# EAGLE design light (EAGLE 7.5.0)
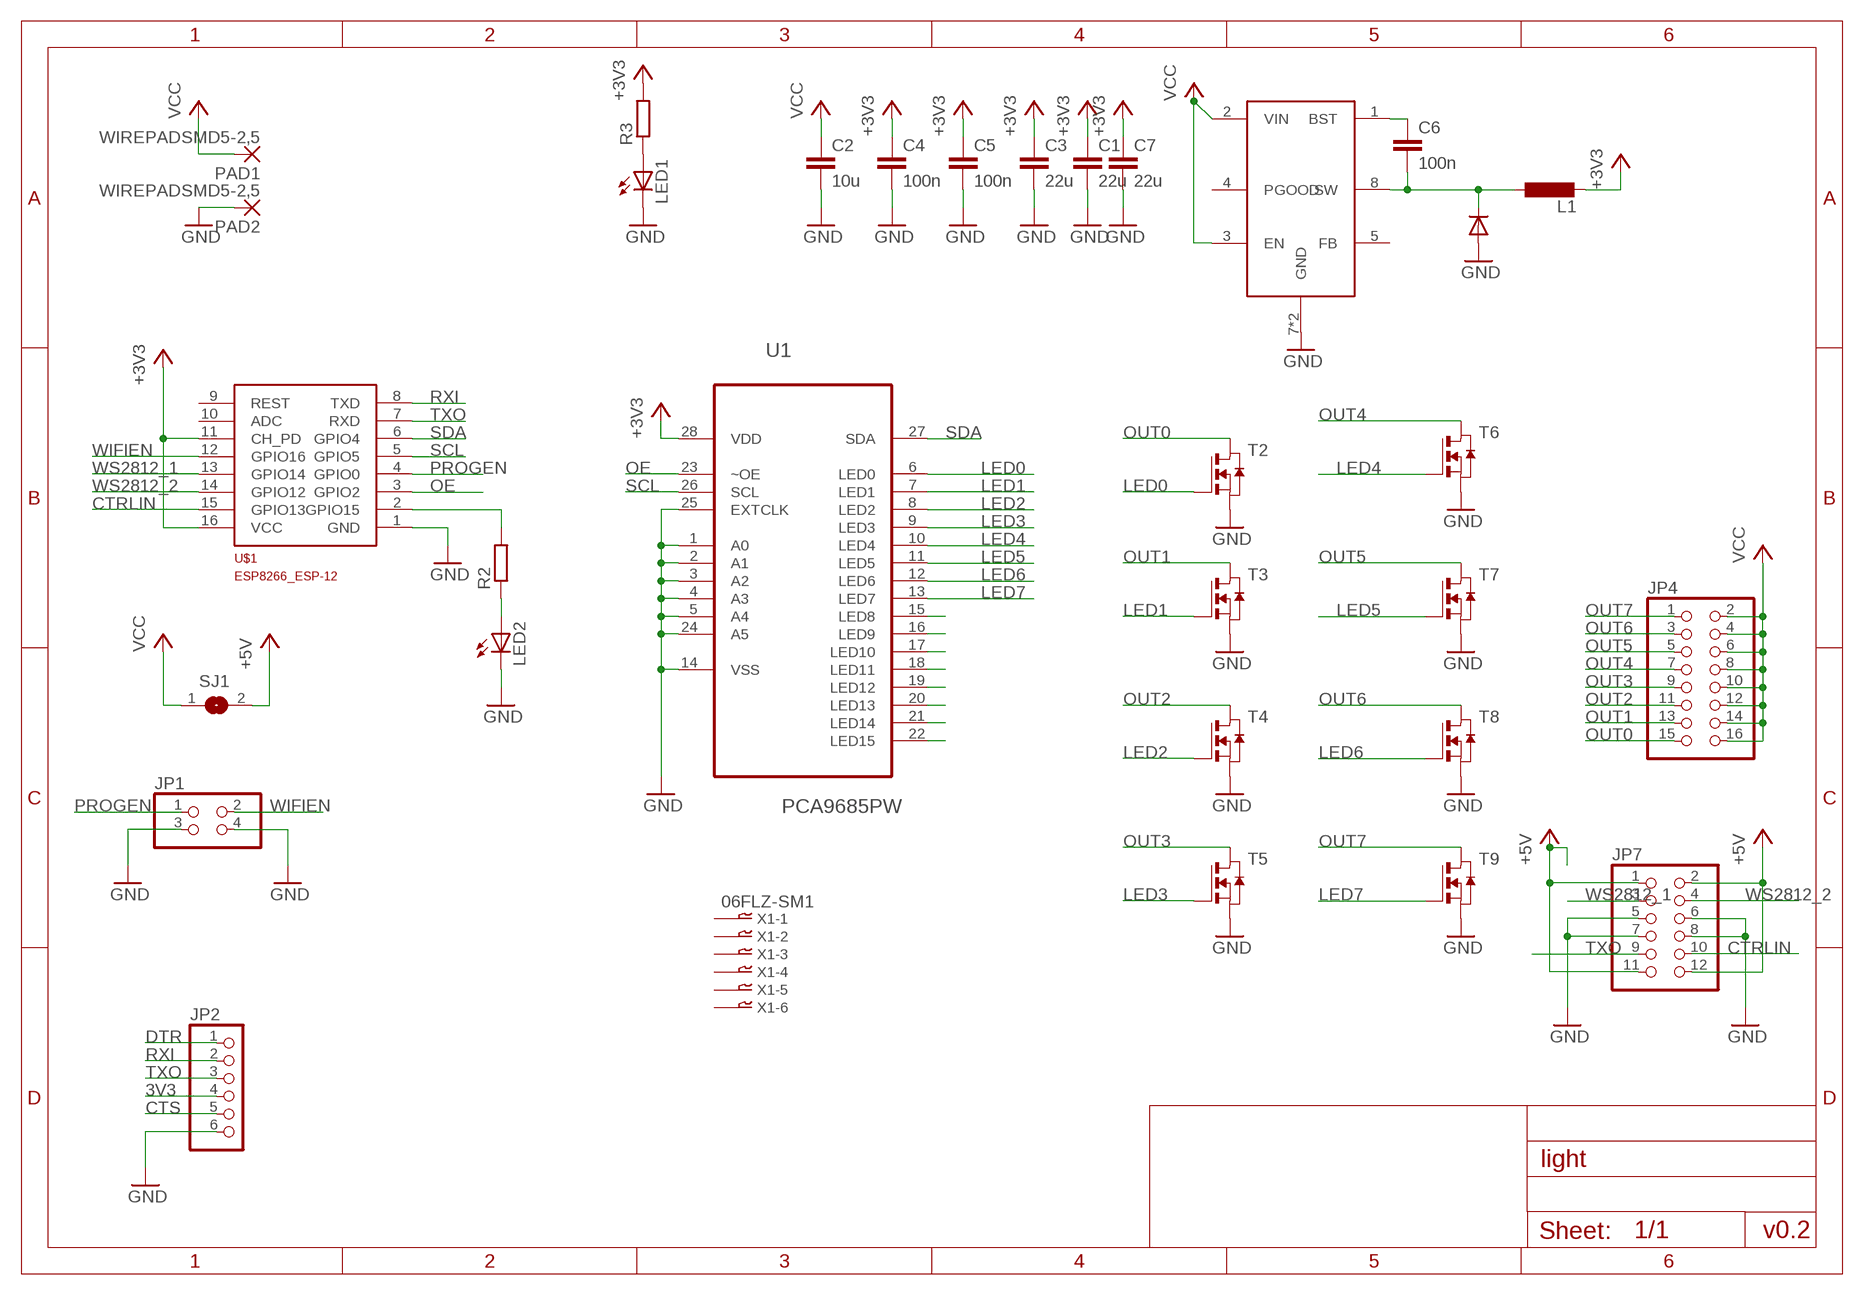
[diagram p0: schematic, sheet 1]

## Parts
C1  22u  C-EUC0805K  [C0805K]
C2  10u  C-EUC0805K  [C0805K]
C3  22u  C-EUC0805K  [C0805K]
C4  100n  C-EUC0603K  [C0603K]
C5  100n  C-EUC0603K  [C0603K]
C6  100n  C-EUC0603K  [C0603K]
C7  22u  C-EUC0805K  [C0805K]
JP1  PINHD-2X2  [2X02]
JP2  PINHD-1X6  [1X06]
JP4  PINHD-2X8  [2X08]
JP7  PINHD-2X6  [2X06]
L1  L-EUL5650M  [L5650M]
LED1  LEDSML0603  [SML0603]
LED2  LEDSML0603  [SML0603]
PAD1  WIREPADSMD5-2,5  [5-2,5]
PAD2  WIREPADSMD5-2,5  [5-2,5]
R2  R-EU_R0603  [R0603]
R3  R-EU_R0603  [R0603]
SJ1  SJ  [SJ]
T2  NMOSSOT23  [SOT-23]
T3  NMOSSOT23  [SOT-23]
T4  NMOSSOT23  [SOT-23]
T5  NMOSSOT23  [SOT-23]
T6  NMOSSOT23  [SOT-23]
T7  NMOSSOT23  [SOT-23]
T8  NMOSSOT23  [SOT-23]
T9  NMOSSOT23  [SOT-23]
U1  PCA9685PW  [SOP65P640X110-28N]
U$1  ESP8266_ESP-12  [ESP8266-ESP12]
U$2  ADP2302  [SOIC8G-1.27-5X4MM]
U$3  SSB43L  [DO-214AA]
X1  06FLZ-SM1  [6FLZ-SM]

## Nets
3V3: JP2.4
+3V3: C1.1 C3.1 C4.1 C5.1 C7.1 L1.2 R3.2 U1.28(VDD) U$1.11(CH_PD) U$1.16(VCC)
+5V: JP7.1 JP7.2 JP7.11 JP7.12 SJ1.2
CTRLIN: JP7.10 U$1.15(GPIO13)
CTS: JP2.5
DTR: JP2.1
GND: C1.2 C2.2 C3.2 C4.2 C5.2 C7.2 JP1.3 JP1.4 JP2.6 JP7.5 JP7.6 JP7.7 JP7.8 LED1.C LED2.C PAD2.1(P) T2.2(S) T3.2(S) T4.2(S) T5.2(S) T6.2(S) T7.2(S) T8.2(S) T9.2(S) U1.1(A0) U1.2(A1) U1.3(A2) U1.4(A3) U1.5(A4) U1.14(VSS) U1.24(A5) U1.25(EXTCLK) U$1.1(GND) U$2.7(GND) U$2.PAD(GND) U$3.+(A)
LED0: T2.3(G) U1.6(LED0)
LED1: T3.3(G) U1.7(LED1)
LED2: T4.3(G) U1.8(LED2)
LED3: T5.3(G) U1.9(LED3)
LED4: T6.3(G) U1.10(LED4)
LED5: T7.3(G) U1.11(LED5)
LED6: T8.3(G) U1.12(LED6)
LED7: T9.3(G) U1.13(LED7)
N$1: LED1.A R3.1
N$2: LED2.A R2.1
N$3: R2.2 U$1.2(GPIO15)
N$4: C6.1 U$2.1(BST)
N$5: U1.15(LED8)
N$6: U1.16(LED9)
N$7: U1.17(LED10)
N$8: U1.18(LED11)
N$9: U1.19(LED12)
N$10: U1.20(LED13)
N$11: U1.21(LED14)
N$12: U1.22(LED15)
N$13: C6.2 L1.1 U$2.8(SW) U$3.-(C)
OE: U1.23(~OE) U$1.3(GPIO2)
OUT0: JP4.15 T2.1(D)
OUT1: JP4.13 T3.1(D)
OUT2: JP4.11 T4.1(D)
OUT3: JP4.9 T5.1(D)
OUT4: JP4.7 T6.1(D)
OUT5: JP4.5 T7.1(D)
OUT6: JP4.3 T8.1(D)
OUT7: JP4.1 T9.1(D)
PROGEN: JP1.1 U$1.4(GPIO0)
RXI: JP2.2 U$1.8(TXD)
SCL: U1.26(SCL) U$1.5(GPIO5)
SDA: U1.27(SDA) U$1.6(GPIO4)
TXO: JP2.3 JP7.9 U$1.7(RXD)
VCC: C2.1 JP4.2 JP4.4 JP4.6 JP4.8 JP4.10 JP4.12 JP4.14 JP4.16 PAD1.1(P) SJ1.1 U$2.2(VIN) U$2.3(EN)
WIFIEN: JP1.2 U$1.12(GPIO16)
WS2812_1: JP7.3 U$1.13(GPIO14)
WS2812_2: JP7.4 U$1.14(GPIO12)
Unconnected: U$1.9(REST) U$1.10(ADC) U$2.4(PGOOD) U$2.5(FB) X1.1 X1.2 X1.3 X1.4 X1.5 X1.6

## Notes on the sheet
- v0.2

## Library data of the parts
C1-C7 = resistor:C-EU: CAPACITOR, European symbol
JP1 = pinhead:PINHD-2X2: PIN HEADER
JP2 = pinhead:PINHD-1X6: PIN HEADER
JP4 = pinhead:PINHD-2X8: PIN HEADER
JP7 = pinhead:PINHD-2X6: PIN HEADER
L1 = resistor:L-EU: INDUCTOR, European symbol
LED1 LED2 = led:LED: LED OSRAM: - CHIPLED LG R971, LG N971, LY N971, LG Q971, LY Q971, LO R971, LY R971 LH N974, LH R974 LS Q976, LO Q976, LY Q976 LO Q996 - Hyper CHIPLED LW Q18S LB Q993, LB Q99A, LB R99A - SideLED LS A670, LO A670, LY A670, LG A670, LP A670 LB A673, LV A673, LT A673, LW A673 LH A674 LY A675 LS A676, LA A676, LO A676, LY A676, LW A676 LS A679, LY A679, LG A679 - Hyper Micro SIDELED® LS Y876, LA Y876, LO Y876, LY Y876 LT Y87S - SmartLED LW L88C, LW L88S LB L89C, LB L89S, LG L890 LS L89K, LO L89K, LY L89K LS L896, LA L896, LO L896, LY L896 - TOPLED LS T670, LO T670, LY T670, LG T670, LP T670 LSG T670, LSP T670, LSY T670, LOP T670, LYG T670 LG T671, LOG T671, LSG T671 LB T673, LV T673, LT T673, LW T673 LH T674 LS T676, LA T676, LO T676, LY T676, LB T676, LH T676, LSB T676, LW T676 LB T67C, LV T67C, LT T67C, LS T67K, LO T67K, LY T67K, LW E67C LS E67B, LA E67B, LO E67B, LY E67B, LB E67C, LV E67C, LT E67C LW T67C LS T679, LY T679, LG T679 LS T770, LO T770, LY T770, LG T770, LP T770 LB T773, LV T773, LT T773, LW T773 LH T774 LS E675, LA E675, LY E675, LS T675 LS T776, LA T776, LO T776, LY T776, LB T776 LHGB T686 LT T68C, LB T68C - Hyper Mini TOPLED® LB M676 - Mini TOPLED Santana® LG M470 LS M47K, LO M47K, LY M47K Source: http://www.osram.convergy.de LUXEON: - LUMILED® LXK2-PW12-R00, LXK2-PW12-S00, LXK2-PW14-U00, LXK2-PW14-V00 LXK2-PM12-R00, LXK2-PM12-S00, LXK2-PM14-U00 LXK2-PE12-Q00, LXK2-PE12-R00, LXK2-PE12-S00, LXK2-PE14-T00, LXK2-PE14-U00 LXK2-PB12-K00, LXK2-PB12-L00, LXK2-PB12-M00, LXK2-PB14-N00, LXK2-PB14-P00, LXK2-PB14-Q00 LXK2-PR12-L00, LXK2-PR12-M00, LXK2-PR14-Q00, LXK2-PR14-R00 LXK2-PD12-Q00, LXK2-PD12-R00, LXK2-PD12-S00 LXK2-PH12-R00, LXK2-PH12-S00 LXK2-PL12-P00, LXK2-PL12-Q00, LXK2-PL12-R00 Source: www.luxeon.com KINGBRIGHT: KA-3528ASYC Source: www.kingbright.com
PAD1 PAD2 = wirepad:WIREPAD: Wire PAD connect wire on PCB
R2 R3 = resistor:R-EU_: RESISTOR, European symbol
SJ1 = jumper:SJ: SMD solder JUMPER
T2-T9 = zetex:NMOSSOT23: MOS FET; OC_FARNELL: unknown; OC_NEWARK: unknown
U1 = PCA9685PW:PCA9685PW: 16-channel, 12-bit PWM Fm+ I2C-bus LED controller; MPN: PCA9685PW; OC_FARNELL: 1854074; OC_NEWARK: 19T6398; PACKAGE: TSSOP-28; SUPPLIER: NXP
U$1 = ESP8266-ESP12:ESP8266_ESP-12
U$2 = library:ADP2302
U$3 = library:SSB43L
X1 = con-jst2:06FLZ-SM1: CONNECTOR

## Board
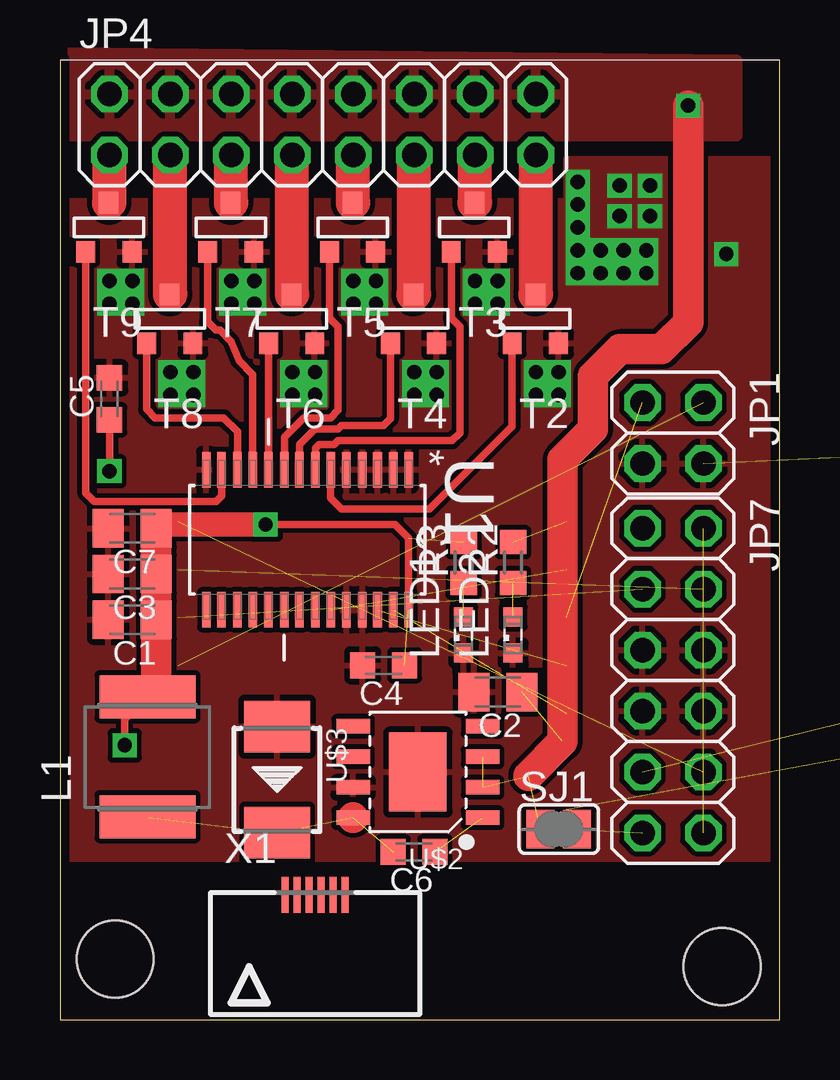
[diagram p1: board, top side]
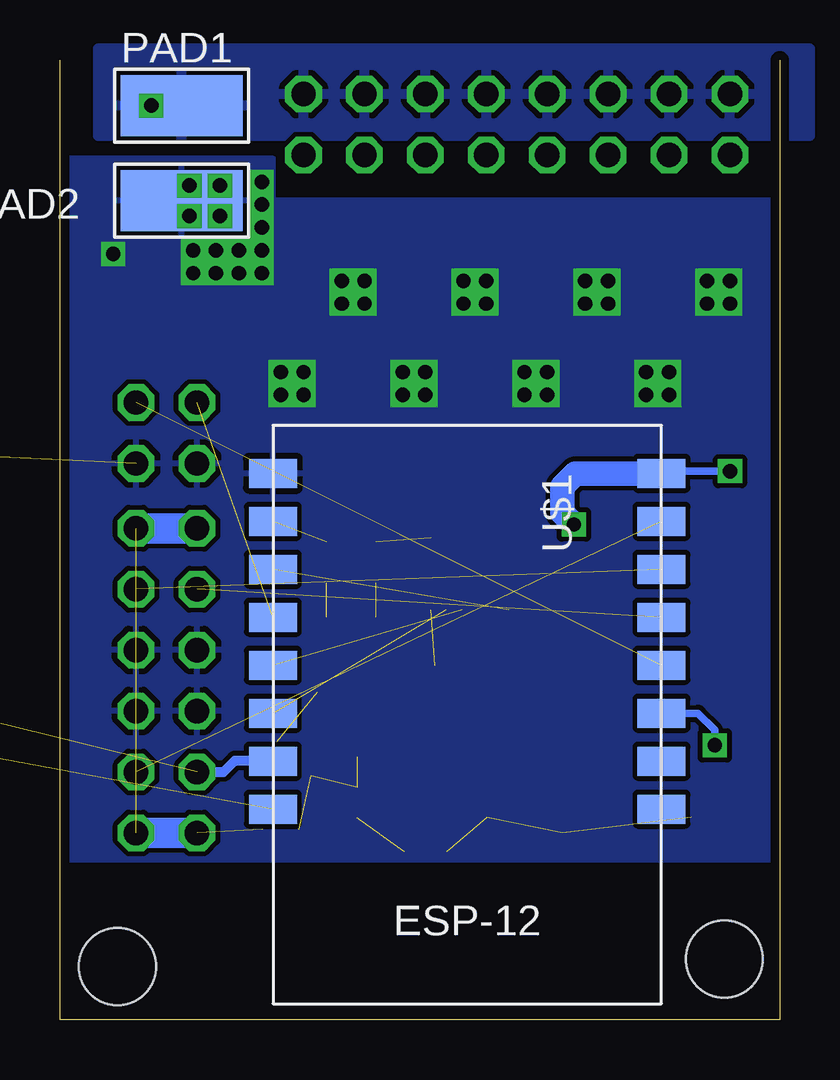
[diagram p2: board, bottom side, seen from below]

Size 30 x 40 mm. Coordinates in mm from the lower left corner, seen from the top.
Outline: 30,40 30,0 0,0 0,40
Copper layers (1*16): Top 0.035mm / dielectric 1.5mm / Bottom 0.035mm
Design rules "default *": minimum track width 8mil, minimum drill 0.5mm, track to track 8mil, track to pad 8mil, pad to pad 8mil, via to via 8mil, smd to smd 0mil, copper to edge 15mil, drill to drill 8mil, minimum pad ring 10mil, minimum via ring 8mil, stop-mask expansion 4mil, vias tented up to drill 0mil, thermal gap 10mil
Holes 3.2 mm at 2.3,2.52 27.61,2.21

### Footprints (pad centres in the part's own frame; a part is rotated, then mirrored left to right if it is on the bottom)
C0805K = smd 1.3 x 1.6: 1 -1,0; 2 1,0
C0603K = smd 1.05 x 1.08: 1 -0.875,0; 2 0.875,0
2X02 = drill 1.016 octagon: 1 -1.27,-1.27; 2 -1.27,1.27; 3 1.27,-1.27; 4 1.27,1.27
1X06 = drill 1.016 long: 1 -6.35,0; 2 -3.81,0; 3 -1.27,0; 4 1.27,0; 5 3.81,0; 6 6.35,0
2X08 = drill 1.016 octagon: 1 -8.89,-1.27; 2 -8.89,1.27; 3 -6.35,-1.27; 4 -6.35,1.27; 5 -3.81,-1.27; 6 -3.81,1.27; 7 -1.27,-1.27; 8 -1.27,1.27; 9 1.27,-1.27; 10 1.27,1.27; 11 3.81,-1.27; 12 3.81,1.27; 13 6.35,-1.27; 14 6.35,1.27; 15 8.89,-1.27; 16 8.89,1.27
2X06 = drill 1.016 octagon: 1 -6.35,-1.27; 2 -6.35,1.27; 3 -3.81,-1.27; 4 -3.81,1.27; 5 -1.27,-1.27; 6 -1.27,1.27; 7 1.27,-1.27; 8 1.27,1.27; 9 3.81,-1.27; 10 3.81,1.27; 11 6.35,-1.27; 12 6.35,1.27
L5650M = smd 1.8 x 4: 1 -2.5,0; 2 2.5,0
SML0603 = smd 0.8 x 0.8: A 0.75,0; C -0.75,0
5-2,5 = smd 2.54 x 5.08: 1 0,0
R0603 = smd 1 x 1.1: 1 -0.85,0; 2 0.85,0
SJ = smd 1.168 x 1.6: 1 -0.762,0; 2 0.762,0
SOT-23 = smd 0.787 x 0.889: 1 0.025,-1.016; 2 -0.94,1.016; 3 0.991,1.016
SOP65P640X110-28N = smd 1.473 x 0.356: 1 -2.921,4.216; 2 -2.921,3.581; 3 -2.921,2.921; 4 -2.921,2.286; 5 -2.921,1.626; 6 -2.921,0.965; 7 -2.921,0.33; 8 -2.921,-0.33; 9 -2.921,-0.965; 10 -2.921,-1.626; 11 -2.921,-2.286; 12 -2.921,-2.921; 13 -2.921,-3.581; 14 -2.921,-4.216; 15 2.921,-4.216; 16 2.921,-3.581; 17 2.921,-2.921; 18 2.921,-2.286; 19 2.921,-1.626; 20 2.921,-0.965; 21 2.921,-0.33; 22 2.921,0.33; 23 2.921,0.965; 24 2.921,1.626; 25 2.921,2.286; 26 2.921,2.921; 27 2.921,3.581; 28 2.921,4.216
ESP8266-ESP12 = smd 2 x 1.2: 1 16.2,2; 2 16.2,4; 3 16.2,6; 4 16.2,8; 5 16.2,10; 6 16.2,12; 7 16.2,14; 8 16.2,16; 9 0,16; 10 0,14; 11 0,12; 12 0,10; 13 0,8; 14 0,6; 15 0,4; 16 0,2
SOIC8G-1.27-5X4MM = smd 0.6 x 1.4: 1 -1.905,-2.7; 2 -0.635,-2.7; 3 0.635,-2.7; 4 1.905,-2.7; 5 1.905,2.7; 6 0.635,2.7; 7 -0.635,2.7; 8 -1.905,2.7 | smd 3.3 x 2.4: PAD 0,0
DO-214AA = smd 2.159 x 2.743: + -2.21,0; - 2.21,0
6FLZ-SM = smd 0.3 x 1.5: 1 -1.25,2.5; 2 -0.75,2.5; 3 -0.25,2.5; 4 0.25,2.5; 5 0.75,2.5; 6 1.25,2.5

### Placement (x,y rotation side)
C1  3.02,16.67 180 top
C2  18.26,13.65 180 top
C3  3.02,18.57 180 top
C4  13.49,14.76 180 top
C5  2.06,25.88 90 top
C6  14.76,6.99 180 top
C7  3.02,20.48 180 top
JP1  25.56,24.45 270 top
JP2  50.16,17.94 90 top  (outside the outline)
JP4  10.95,37.31 0 top
JP7  25.56,14.13 270 top
L1  3.65,10.95 90 top
LED1  16.83,16.03 90 top
LED2  18.89,16.03 90 top
PAD1  24.92,38.1 270 bottom
PAD2  24.92,34.13 270 bottom
R2  18.89,19.05 90 top
R3  16.83,19.05 90 top
SJ1  20.8,7.94 0 top
T2  19.84,29.21 180 top
T3  17.3,33.02 180 top
T4  14.76,29.21 180 top
T5  12.22,33.02 180 top
T6  9.68,29.21 180 top
T7  7.14,33.02 180 top
T8  4.6,29.21 180 top
T9  2.06,33.02 180 top
U1  10.32,20 270 top
U$1  4.92,24.77 180 bottom
U$2  14.92,10.32 90 top
U$3  9.05,10 270 top
X1  10.64,2.7 0 top

### Tracks (layer width: path | path; a pad name or v marks a point on that pad's centre or on a via)
+3V3  (via drill 0.6)  (2 unrouted)
  Top 0.305: U1.28 14.54,20.07 13.97,20.64 v8.57,20.64 | v2.7,11.43 2.7,12.5 L1.2 | C5.1 v2.06,22.86
  Top 1.016: v8.57,20.64 4.17,20.64 C7.1
  Top 1.27: C7.1 C3.1 C1.1 4.02,13.82 L1.2
  Bottom 0.305: U$1.11 3.4,12.77 2.7,12.06 v2.7,11.43 | v2.06,22.86 4.83,22.86 U$1.16
  Bottom 1.016: U$1.16 8.51,22.77 9.05,22.23 9.05,21.11 v8.57,20.64
+5V  (2 unrouted)
  Bottom 1.27: JP7.11 JP7.12 | JP7.1 JP7.2
CTRLIN  (1 unrouted)
GND  (via drill 0.6)  (1 unrouted)
  other vias: 3.02,30.8 2.06,30.8 2.06,29.84 3.02,29.84 8.1,30.8 8.1,29.84 7.14,30.8 7.14,29.84 5.56,26.99 5.56,26.04 4.6,26.99 4.6,26.04 10.64,26.99 10.64,26.04 9.68,26.04 9.68,26.99 13.18,30.8 18.26,30.8 12.22,30.8 17.3,30.8 12.22,29.84 17.3,29.84 13.18,29.84 18.26,29.84 15.72,26.99 20.8,26.99 14.76,26.99 19.84,26.99 15.72,26.04 20.8,26.04 14.76,26.04 19.84,26.04 27.78,31.91 23.34,33.5 23.34,34.77 24.61,34.77 24.61,33.5 23.5,32.07 24.45,32.07 23.5,31.11 24.45,31.11 22.54,31.11 22.54,32.07 21.59,32.07 21.59,31.11 21.59,33.02 21.59,33.97 21.59,34.92
  pour Bottom: -1.59,34.13 21.11,34.13 21.11,35.88 29.69,35.88 29.69,6.67 -1.43,6.67
  pour Top: -5.08,34.13 21.11,34.13 21.11,35.88 30.8,35.88 30.96,6.67 -5.08,6.67
LED0
  Top 0.305: T2.3 18.85,24.73 15.4,21.27 11.75,21.27 11.28,21.74 U1.6
LED1
  Top 0.305: T3.3 16.31,29.25 16.67,28.89 16.67,24.45 16.35,24.13 11.59,24.13 11.43,23.97 10.79,23.97 10.65,23.82 U1.7
LED2
  Top 0.305: T4.3 13.77,25.04 13.49,24.77 11.75,24.77 11.59,24.61 10.64,24.61 9.99,23.96 U1.8
LED3
  Top 0.305: T5.3 11.23,29.25 11.59,28.89 11.59,25.4 11.27,25.08 10.16,25.08 9.37,24.29 9.37,22.94 U1.9
LED4
  Top 0.305: 8.73,28.16 T6.3 U1.10
LED5
  Top 0.305: T7.3 6.15,29.09 6.51,28.73 6.67,28.73 7.14,28.26 7.46,27.46 8.03,26.89 U1.11
LED6
  Top 0.305: T8.3 3.61,25.44 3.97,25.08 6.83,25.08 7.4,24.51 U1.12
LED7
  Top 0.305: U1.13 6.74,21.82 6.51,21.59 1.43,21.59 1.07,21.95 T9.3
N$1  (1 unrouted)
N$2  (1 unrouted)
N$3  (1 unrouted)
N$4  (1 unrouted)
N$13  (3 unrouted)
  Top 1.27: L1.1 3.68,8.43 | U$2.8 12.21,8.43
OE  (1 unrouted)
OUT0
  Top 1.422: T2.1 19.84,30.25 JP4.15
OUT1
  Top 1.422: T3.1 17.3,34.06 JP4.13
OUT2
  Top 1.422: T4.1 14.76,30.25 JP4.11
OUT3
  Top 1.422: T5.1 12.22,34.06 JP4.9
OUT4
  Top 1.422: T6.1 9.68,30.25 JP4.7
OUT5
  Top 1.422: T7.1 7.14,34.06 JP4.5
OUT6
  Top 1.422: T8.1 4.6,30.25 JP4.3
OUT7
  Top 1.422: T9.1 2.06,34.06 JP4.1
PROGEN  (1 unrouted)
RXI  (1 unrouted)
SCL  (1 unrouted)
SDA  (1 unrouted)
TXO  (1 unrouted)
  Bottom 0.406: JP7.9 23.18,10.32 22.7,10.79 21.15,10.79 U$1.7
VCC  (via drill 0.6)  (4 unrouted)
  Top 1.27: v26.19,38.1 26.19,29.05 25.08,27.94 23.34,27.94 22.23,26.83 22.23,24.61 20.95,23.34 20.95,11.59 19.53,10.16
  Bottom 1.27: 24.61,38.1 PAD1.1 v26.19,38.1
  pour Bottom: -1.27,40.48 -1.27,36.83 27.46,36.83 27.46,40.48
  pour Top: 0.16,40.32 0.16,36.83 28.26,36.83 28.26,40.01
  pour Bottom: -0.79,40.48 -0.79,36.83 28.42,36.83 28.42,40.48
WIFIEN  (1 unrouted)
WS2812_1  (1 unrouted)
WS2812_2  (1 unrouted)